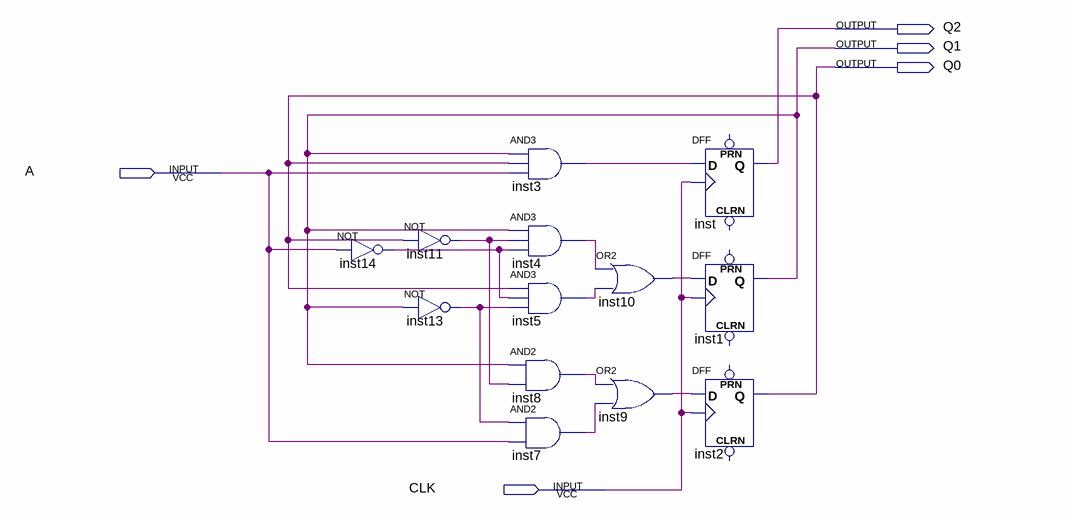
[diagram p0: schematic sheet]
// Quartus schematic 8thMSSV.bdf as structural Verilog: 13 symbols, 5 pins
module \8thMSSV  (
  input  A,
  input  CLK,
  output Q2,
  output Q1,
  output Q0
);

  wire inst3_out, inst4_out, inst5_out, inst7_out, inst8_out, inst9_out, inst10_out, inst11_out, inst13_out,
       inst14_out;

  not inst14 (inst14_out, A);
  not inst11 (inst11_out, Q0);
  not inst13 (inst13_out, Q1);
  and inst3 (inst3_out, Q1, Q0, A);
  and inst4 (inst4_out, Q1, inst11_out, inst14_out);
  and inst5 (inst5_out, Q0, inst14_out, inst13_out);
  and inst8 (inst8_out, Q1, inst11_out);
  and inst7 (inst7_out, inst13_out, A);
  or inst10 (inst10_out, inst4_out, inst5_out);
  or inst9 (inst9_out, inst8_out, inst7_out);
  DFF inst (.CLK(CLK), .D(inst3_out), .Q(Q2));  // open: CLRN, PRN
  DFF inst1 (.CLK(CLK), .D(inst10_out), .Q(Q1));  // open: CLRN, PRN
  DFF inst2 (.CLK(CLK), .D(inst9_out), .Q(Q0));  // open: CLRN, PRN
endmodule
